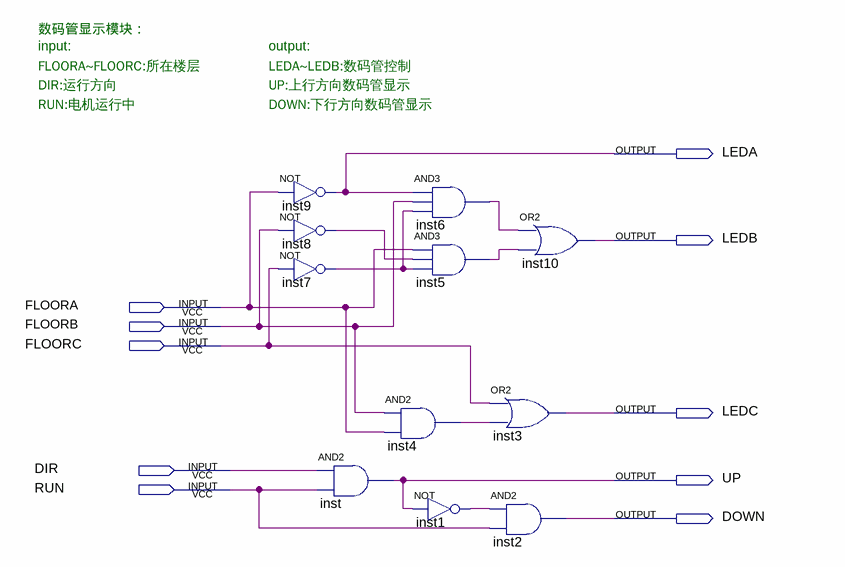
[diagram p0: schematic sheet]
// Quartus schematic display.bdf as structural Verilog: 11 symbols, 10 pins
module display (
  input  FLOORA,
  input  FLOORB,
  input  FLOORC,
  input  DIR,
  input  RUN,
  output LEDA,
  output LEDB,
  output LEDC,
  output UP,
  output DOWN
);

  wire inst1_out, inst4_out, inst5_out, inst6_out, inst7_out, inst8_out;

  not inst9 (LEDA, FLOORA);
  not inst8 (inst8_out, FLOORB);
  not inst7 (inst7_out, FLOORC);
  and inst (UP, DIR, RUN);
  and inst6 (inst6_out, LEDA, FLOORB, inst7_out);
  and inst5 (inst5_out, FLOORA, inst8_out, inst7_out);
  and inst4 (inst4_out, FLOORB, FLOORA);
  not inst1 (inst1_out, UP);
  or inst3 (LEDC, FLOORC, inst4_out);
  and inst2 (DOWN, inst1_out, RUN);
  or inst10 (LEDB, inst6_out, inst5_out);

  // Notes on the sheet:
  //   数码管显示模块：
  //   input:
  //   output:
  //   FLOORA~FLOORC:所在楼层
  //   LEDA~LEDB:数码管控制
  //   DIR:运行方向
  //   UP:上行方向数码管显示
  //   RUN:电机运行中
  //   DOWN:下行方向数码管显示
endmodule
